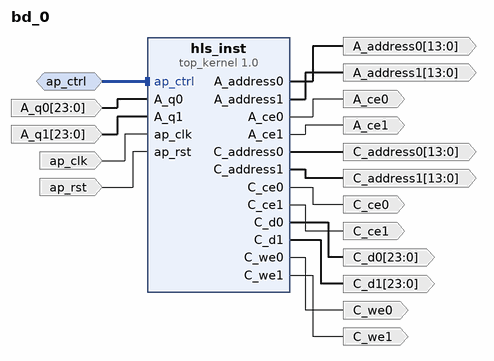
[diagram p0: block diagram of the top level]
# Vivado block design bd_0, xczu3eg-sbva484-1-e, Vivado 2025.1.1
create_bd_design bd_0

create_bd_intf_port -mode Slave -vlnv xilinx.com:interface:acc_handshake_rtl:1.0 ap_ctrl
create_bd_port -dir O -from 13 -to 0 -type data A_address0
create_bd_port -dir O -from 13 -to 0 A_address1
create_bd_port -dir O A_ce0
create_bd_port -dir O A_ce1
create_bd_port -dir I -from 23 -to 0 -type data A_q0
create_bd_port -dir I -from 23 -to 0 A_q1
create_bd_port -dir O -from 13 -to 0 -type data C_address0
create_bd_port -dir O -from 13 -to 0 -type data C_address1
create_bd_port -dir O C_ce0
create_bd_port -dir O C_ce1
create_bd_port -dir O -from 23 -to 0 -type data C_d0
create_bd_port -dir O -from 23 -to 0 -type data C_d1
create_bd_port -dir O C_we0
create_bd_port -dir O C_we1
create_bd_port -dir I -type clk ap_clk
set_property -dict {CONFIG.FREQ_HZ 100000000.0} [get_bd_ports ap_clk]
create_bd_port -dir I -type rst ap_rst
set_property -dict {CONFIG.POLARITY ACTIVE_HIGH} [get_bd_ports ap_rst]

create_bd_cell -type ip -vlnv xilinx.com:hls:top_kernel:1.0 hls_inst

# ---- connections ----

connect_bd_intf_net -intf_net ap_ctrl_0_1 [get_bd_intf_ports ap_ctrl] [get_bd_intf_pins hls_inst/ap_ctrl]
connect_bd_net -net A_q0_0_1 [get_bd_ports A_q0] [get_bd_pins hls_inst/A_q0]
connect_bd_net -net A_q1_0_1 [get_bd_ports A_q1] [get_bd_pins hls_inst/A_q1]
connect_bd_net -net ap_clk_0_1 [get_bd_ports ap_clk] [get_bd_pins hls_inst/ap_clk]
connect_bd_net -net ap_rst_0_1 [get_bd_ports ap_rst] [get_bd_pins hls_inst/ap_rst]
connect_bd_net [get_bd_pins hls_inst/A_address0] [get_bd_ports A_address0]
connect_bd_net [get_bd_pins hls_inst/A_address1] [get_bd_ports A_address1]
connect_bd_net [get_bd_pins hls_inst/A_ce0] [get_bd_ports A_ce0]
connect_bd_net [get_bd_pins hls_inst/A_ce1] [get_bd_ports A_ce1]
connect_bd_net [get_bd_pins hls_inst/C_address0] [get_bd_ports C_address0]
connect_bd_net [get_bd_pins hls_inst/C_address1] [get_bd_ports C_address1]
connect_bd_net [get_bd_pins hls_inst/C_ce0] [get_bd_ports C_ce0]
connect_bd_net [get_bd_pins hls_inst/C_ce1] [get_bd_ports C_ce1]
connect_bd_net [get_bd_pins hls_inst/C_d0] [get_bd_ports C_d0]
connect_bd_net [get_bd_pins hls_inst/C_d1] [get_bd_ports C_d1]
connect_bd_net [get_bd_pins hls_inst/C_we0] [get_bd_ports C_we0]
connect_bd_net [get_bd_pins hls_inst/C_we1] [get_bd_ports C_we1]

validate_bd_design
save_bd_design
